# Altium schematic sheet DS137-1.0-C二氧化硫传感器.SchDoc
size A4; SheetNumber: 1; SheetTotal: 2
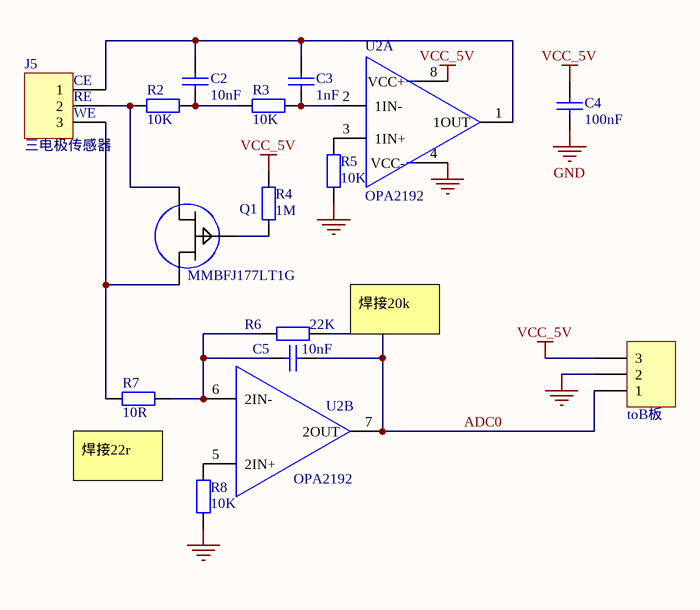
[diagram p0: DS137-1.0-C二氧化硫传感器.SchDoc]

## Parts
?  value toB板  [XH2.54-3P]  (hidden comment: SL000000028)
C2  value 10nF  [0603CAP]  (hidden comment: SMDCAP00010)
C3  value 1nF  [0603CAP]  (hidden comment: SMDCAP00008)
C4  value 100nF  [0603CAP]  (hidden comment: SMDCAP00013)
C5  value 10nF  [0603CAP]  (hidden comment: SMDCAP00010)
J5  value 三电极传感器  [3_Electrode]  (hidden comment: SL000000042)
Q1  MMBFJ177LT1G  [SOT23]
R2  value 10K  [0603RES]  (hidden comment: SMDRES00056)
R3  value 10K  [0603RES]  (hidden comment: SMDRES00056)
R4  value 1M  [0603RES]  (hidden comment: SMDRES00085)
R5  value 10K  [0603RES]  (hidden comment: SMDRES00056)
R6  value 22K  [0603RES]  (hidden comment: SMDRES00108)
R7  value 10R  [0603RES]  (hidden comment: SMDRES00005)
R8  value 10K  [0603RES]  (hidden comment: SMDRES00056)
U2  OPA2192  [SO-8]  (parts A,B of 2)

## Nets
GND: ?.2 C4.1 R5.1 R8.1 U2.4(VCC-)
VCC_5V: ?.3 C4.2 R4.2 U2.8(VCC+)
ADC0: ?.1 C5.1 R6.2 U2.7(2OUT)
NetC2_1: C2.1 R2.2 R3.1
NetC2_2: C2.2 C3.2 J5.1 U2.1(1OUT)
NetC3_1: C3.1 R3.2 U2.2(1IN-)
NetC5_2: C5.2 R6.1 R7.2 U2.6(2IN-)
NetJ5_2: J5.2 Q1.1(D) R2.1
NetJ5_3: J5.3 Q1.2(S) R7.1
NetQ1_3: Q1.3(G) R4.1
NetR5_2: R5.2 U2.3(1IN+)
NetR8_2: R8.2 U2.5(2IN+)

## Notes on the sheet
- (near J5) CE
- (near J5) RE
- (near J5) WE
- 焊接20k
- 焊接22r

## Library data of the parts
? = XH2.54mm-3A 直针座: 3P直针座
C2 C5 = MLCC 10nF 50V ±10％ 0603: 贴片电容
C3 = MLCC 1nF 50V ±10％ 0603: 贴片电容
C4 = MLCC 100nF 50V ±10％ 0603: 贴片电容
J5 = DIP3 单排直针 间距2.54mm 针长11mm 铜: 单排直针
Q1 = J177: P沟道JFET 结型场效应管(JFET) 适用于模拟开关和斩波器应用。
R2 R3 R5 R8 = Chip 10K 1/16W ±1％ 0603: 贴片电阻
R4 = Chip 1M 1/16W ±1％ 0603: 贴片电阻
R6 = Chip 22K 1/16W ±1％ 0603: 贴片电阻
R7 = Chip 10R 1/16W ±1％ 0603: 贴片电阻
U2 = TL062C